# Altium schematic sheet TL431C1 (V-ref adj).schdoc
size 124 x 101 mm
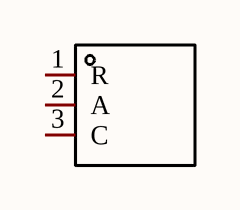
[diagram p0: TL431C1 (V-ref adj).schdoc]

## Parts
U?  TL431C  [TO-92-3_L4.9-W3.7-P1.27-L]  (value not drawn)

## Nets

Not connected (* = marked no-connect by the designer): U? 1(R) 2(A) 3(C)

## Library data of the parts
U? = TL431C: Manufacturer: HTC; Add into BOM: yes; Output Type: Adjustable; Output Voltage: 2.495V~40V; Output Current: 150mA; Minimum Cathode Current for Regulation: 500uA; Symbol: TL431C; Device: TL431C; LCSC Part Name: TL431C; Supplier Part: C262796; Manufacturer Part: TL431C; Supplier Footprint: TO-92-3; JLCPCB Part Class: Extended Part; Datasheet: https://atta.szlcsc.com/upload/public/pdf/source/20180803/C262799_06AF9BC68CBEBF07BA375EA9100504A9.pdf; Supplier: LCSC; Convert to PCB: yes; Operating Temperature: -40℃~+125℃@(TA)